# Altium schematic sheet CATS-EUROC-PM.SchDoc: CATS EuRoC Edition
size A4; DocumentNumber: Overview; Revision: V1.0; SheetNumber: 3; SheetTotal: 16; Author: Luca Jost; Subtitle: Power Management
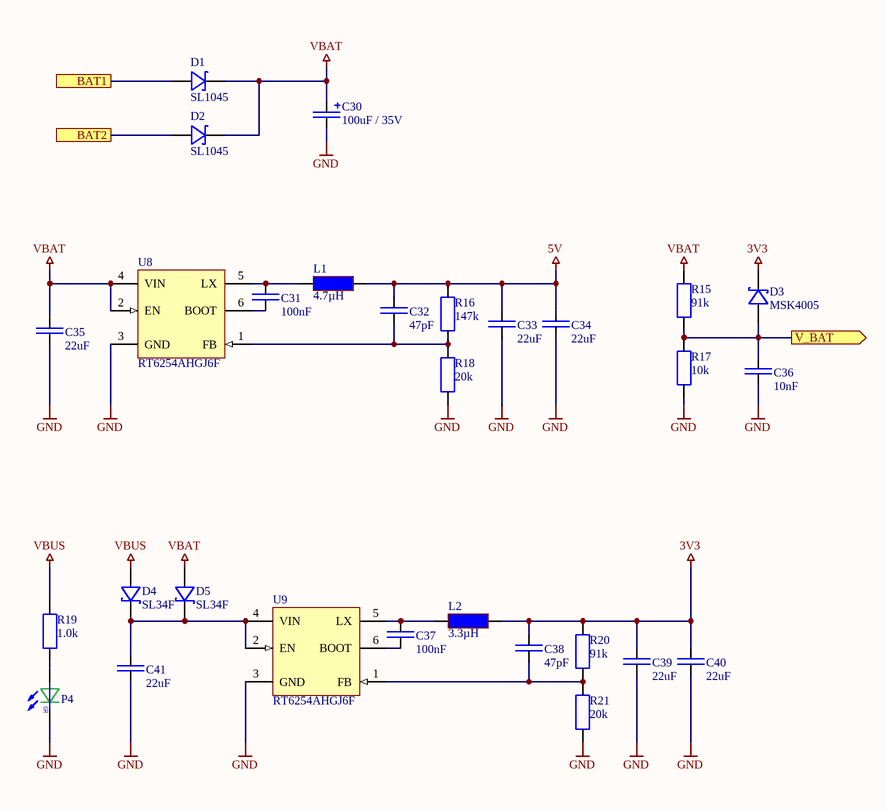
[diagram p0: CATS-EUROC-PM.SchDoc]

## Parts
C30  100uF / 35V  [SMD Elko 6.3x7.7]
C31  100nF  [SMD Keramikkondensator 0402]
C32  47pF  [SMD Keramikkondensator 0402]
C33  22uF  [SMD Keramikkondensator 0805]
C34  22uF  [SMD Keramikkondensator 0805]
C35  22uF  [SMD Keramikkondensator 0805]
C36  10nF  [SMD Keramikkondensator 0402]
C37  100nF  [SMD Keramikkondensator 0402]
C38  47pF  [SMD Keramikkondensator 0402]
C39  22uF  [SMD Keramikkondensator 0805]
C40  22uF  [SMD Keramikkondensator 0805]
C41  22uF  [SMD Keramikkondensator 0805]
D1  SL1045  [SMD Diode TO-277]
D2  SL1045  [SMD Diode TO-277]
D3  MSK4005  [SMD Diode SOD-523]
D4  SL34F  [SMD Diode SMAF]
D5  SL34F  [SMD Diode SMAF]
L1  4.7µH  [SMD Inductor 5.5x5.2x3]
L2  3.3µH  [SMD Inductor 2x2.5x1.2]
P4  LED  [SMD LED 0603]  (value not drawn)
R15  91k  [SMD Widerstand 0402]
R16  147k  [SMD Widerstand 0402]
R17  10k  [SMD Widerstand 0402]
R18  20k  [SMD Widerstand 0402]
R19  1.0k  [SMD Widerstand 0402]
R20  91k  [SMD Widerstand 0402]
R21  20k  [SMD Widerstand 0402]
U8  RT6254AHGJ6F  [SMD IC TSOT-23-6]
U9  RT6254AHGJ6F  [SMD IC TSOT-23-6]

## Ports
BAT1, BAT2, V_BAT (out)

## Nets
3V3: C38.2 C39.2 C40.2 D3.K L2.2 R20.2
5V: C32.2 C33.2 C34.2 L1.2 R16.2
GND: C30.M(-) C33.1 C34.1 C35.1 C36.1 C39.1 C40.1 C41.1 P4.K R17.1 R18.1 R21.1 U8.3(GND) U9.3(GND)
VBAT: C30.P(+) C35.2 D1.K D2.K D5.A R15.2 U8.2(EN) U8.4(VIN)
VBUS: D4.A R19.2
BAT1: D1.A ; port BAT1
BAT2: D2.A ; port BAT2
V_BAT: C36.2 D3.A R15.1 R17.2 ; port V_BAT
NetC31_1: C31.1 U8.6(BOOT)
NetC31_2: C31.2 L1.1 U8.5(LX)
NetC32_1: C32.1 R16.1 R18.2 U8.1(FB)
NetC37_1: C37.1 U9.6(BOOT)
NetC37_2: C37.2 L2.1 U9.5(LX)
NetC38_1: C38.1 R20.1 R21.2 U9.1(FB)
NetC41_2: C41.2 D4.K D5.K U9.2(EN) U9.4(VIN)
NetP4_A: P4.A R19.1

## Notes on the sheet
- Title
- Author:
- Subtitle
- Date:
- Rev:
- File:
- Sheet
- of
- (in symbol LED) GR

## Library data of the parts
C30 = 100uF / 35V: 7.7mm 6.3mm 50V 47uF 2000hrs 105℃ -55℃~+105℃ SMD,6.3x7.7mm Aluminum Electrolytic Capacitors - SMD ROHS; ComponentLink1Description: Datasheet; ComponentLink1URL: https://datasheet.lcsc.com/lcsc/1809301215_Nichicon-UWT1V101MCL1GS_C125975.pdf; JLC: C125975
C31 C37 = E6 - 100nF: SMD Ceramic Capacitor E6; Unit Price: 0.01; Number: -; Supplier: -; JLC: C307331
C32 C38 = E6 - 47pF: SMD Ceramic Capacitor E6; Unit Price: 0.01; Number: -; Supplier: -; JLC: C1567
C33-C35 C39-C41 = E6 - 22uF: SMD Ceramic Capacitor E6; Unit Price: 0.01; Number: -; Supplier: -; JLC: C45783
C36 = E6 - 10nF: SMD Ceramic Capacitor E6; Unit Price: 0.01; Number: -; Supplier: -; JLC: C15195
D1 D2 = SL1045: 45V 470mV@10A 10A TO-277 Schottky Barrier Diodes; ComponentLink1Description: Datasheet; ComponentLink1URL: https://datasheet.lcsc.com/lcsc/1810252210_MDD-Microdiode-Electronics--SL1045_C65021.pdf; JLC: C113945
D3 = MSK4005: SOD-523 Schottky Barrier Diode; ComponentLink1Description: Datasheet; ComponentLink1URL: https://datasheet.lcsc.com/lcsc/1912111437_Shikues-MSK4005_C345957.pdf; JLC: C345957
D4 D5 = SL34F: 3A SMAF Schottky Barrier Diode; JLC: C60396; ComponentLink1Description: Datasheet; ComponentLink1URL: https://datasheet.lcsc.com/lcsc/1809211527_MDD-Microdiode-Electronics--SL34F_C113938.pdf
L1 = Inductor 4.7µH / 4.5A: 4.7 µH Shielded Molded Inductor 4.5 A 60mOhm Max Nonstandard; Digikey: 541-1238-2-ND; ComponentLink1Description: Datasheet; ComponentLink1URL: https://www.vishay.com/docs/34260/ihlp2020cz11.pdf; JLC: C408410
L2 = Inductor 3.3µH / 1.15A: 1.15A 3.3uH ±20% 144mΩ SMD Power Inductors; Digikey: 732-5680-2-ND; ComponentLink1Description: Datasheet; ComponentLink1URL: https://datasheet.lcsc.com/lcsc/2110081330_Sunlord-SPH252012H3R3MT_C98379.pdf; JLC: C98379
P4 = LED: Color LED
R15 R20 = E24 - 91k: SMD Chip Resistor E24; Unit Price: 0.01; Number: -; Supplier: -; JLC: C4147
R16 = E96 - 147k: SMD Chip Resistor E96; Unit Price: 0.01; Number: -; Supplier: -; JLC: C64171
R17 = E24 - 10k: SMD Chip Resistor E24; Unit Price: 0.01; Number: -; Supplier: -; JLC: C25744
R18 R21 = E96 - 20k: SMD Chip Resistor E96; Unit Price: 0.01; Number: -; Supplier: -; JLC: C25765
R19 = E24 - 1.0k: SMD Chip Resistor E24; Unit Price: 0.01; Number: -; Supplier: -; JLC: C11702
U8 U9 = RT6254AHGJ6F: Buck Switching Regulator IC Positive Adjustable 0.6V 1 Output 4A SOT-23-6 Thin, TSOT-23-6; ComponentLink1Description: Datasheet; ComponentLink1URL: https://www.richtek.com/assets/product_file/RT6254A=RT6254B/DS6254AB-02.pdf; Digikey: RT6255AHGJ6FCT-ND